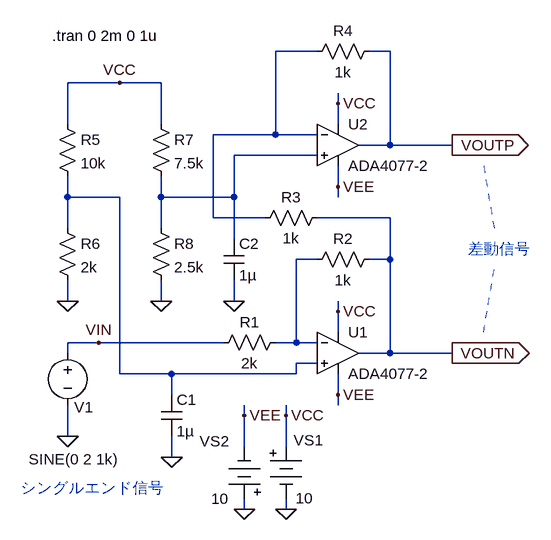
[diagram p0: schematic fig-02-06-09.asc]
fig-02-06-09.asc, the LTspice schematic file:
Version 4
SHEET 1 880 724
WIRE 176 0 112 0
WIRE 288 0 256 0
WIRE -128 48 -208 48
WIRE -64 48 -128 48
WIRE 208 80 208 64
WIRE -208 112 -208 48
WIRE -64 112 -64 48
WIRE 208 112 208 80
WIRE 112 128 112 0
WIRE 112 128 16 128
WIRE 176 128 112 128
WIRE 288 144 288 0
WIRE 288 144 240 144
WIRE 384 144 288 144
WIRE 176 160 48 160
WIRE 208 208 208 176
WIRE -208 224 -208 192
WIRE -128 224 -208 224
WIRE -64 224 -64 192
WIRE 48 224 48 160
WIRE 48 224 -64 224
WIRE 208 224 208 208
WIRE 16 256 16 128
WIRE 96 256 16 256
WIRE 288 256 176 256
WIRE -208 272 -208 224
WIRE -64 272 -64 224
WIRE 48 288 48 224
WIRE 176 320 144 320
WIRE 288 320 288 256
WIRE 288 320 256 320
WIRE -208 384 -208 352
WIRE -64 384 -64 352
WIRE 48 384 48 352
WIRE 208 400 208 384
WIRE 208 432 208 400
WIRE -160 448 -208 448
WIRE 32 448 -160 448
WIRE 144 448 144 320
WIRE 144 448 112 448
WIRE 176 448 144 448
WIRE -208 464 -208 448
WIRE 288 464 288 320
WIRE 288 464 240 464
WIRE 384 464 288 464
WIRE 176 480 144 480
WIRE -128 496 -128 224
WIRE -48 496 -128 496
WIRE 144 496 144 480
WIRE 144 496 -48 496
WIRE -48 528 -48 496
WIRE 208 528 208 496
WIRE 208 544 208 528
WIRE 64 560 64 544
WIRE 128 560 128 544
WIRE -208 592 -208 544
WIRE 64 608 64 560
WIRE 128 608 128 560
WIRE -48 624 -48 592
WIRE 64 704 64 688
WIRE 128 704 128 688
FLAG -208 592 0
FLAG 384 464 VOUTN
IOPIN 384 464 Out
FLAG -160 448 VIN
FLAG 64 704 0
FLAG 128 704 0
FLAG 64 560 VEE
FLAG 128 560 VCC
FLAG 208 80 VCC
FLAG 208 208 VEE
FLAG 208 400 VCC
FLAG 208 528 VEE
FLAG 384 144 VOUTP
IOPIN 384 144 Out
FLAG -48 624 0
FLAG -64 384 0
FLAG -208 384 0
FLAG 48 384 0
FLAG -128 48 VCC
SYMBOL voltage -208 448 R0
WINDOW 0 10 99 Left 2
WINDOW 3 -60 179 Left 2
WINDOW 123 0 0 Left 0
WINDOW 39 0 0 Left 0
SYMATTR InstName V1
SYMATTR Value SINE(0 2 1k)
SYMBOL Misc\\battery 128 592 R0
WINDOW 0 12 6 Left 2
WINDOW 3 15 95 Left 2
SYMATTR InstName VS1
SYMATTR Value 10
SYMBOL Misc\\battery 64 704 R180
WINDOW 0 24 104 Left 2
WINDOW 3 24 16 Left 2
WINDOW 123 0 0 Left 0
WINDOW 39 0 0 Left 0
SYMATTR InstName VS2
SYMATTR Value 10
SYMBOL Opamps\\ADA4077-2 208 80 R0
SYMATTR InstName U2
SYMBOL res 128 432 R90
WINDOW 0 0 56 VBottom 2
WINDOW 3 32 56 VTop 2
SYMATTR InstName R1
SYMATTR Value 2k
SYMBOL Opamps\\ADA4077-2 208 400 R0
SYMATTR InstName U1
SYMBOL res 272 304 R90
WINDOW 0 0 56 VBottom 2
WINDOW 3 32 56 VTop 2
SYMATTR InstName R2
SYMATTR Value 1k
SYMBOL res 192 240 R90
WINDOW 0 0 56 VBottom 2
WINDOW 3 32 56 VTop 2
SYMATTR InstName R3
SYMATTR Value 1k
SYMBOL res 272 -16 R90
WINDOW 0 0 56 VBottom 2
WINDOW 3 32 56 VTop 2
SYMATTR InstName R4
SYMATTR Value 1k
SYMBOL res -224 96 R0
SYMATTR InstName R5
SYMATTR Value 10k
SYMBOL res -224 256 R0
SYMATTR InstName R6
SYMATTR Value 2k
SYMBOL res -80 96 R0
SYMATTR InstName R7
SYMATTR Value 7.5k
SYMBOL res -80 256 R0
SYMATTR InstName R8
SYMATTR Value 2.5k
SYMBOL cap -64 528 R0
SYMATTR InstName C1
SYMATTR Value 1µ
SYMBOL cap 32 288 R0
SYMATTR InstName C2
SYMATTR Value 1µ
TEXT -232 -24 Left 2 !.tran 0 2m 0 1u
TEXT -280 672 Left 2 ;シングルエンド信号
TEXT 408 304 Left 2 ;差動信号
LINE Normal 432 176 448 272 2
LINE Normal 432 432 448 336 2
LINE Normal 432 432 432 432 2

The netlist it stands for:
* fig-02-06-09.asc
V1 VIN 0 SINE(0 2 1k)
VS1 VCC 0 10
VS2 0 VEE 10
XU2 N002 N001 VCC VEE VOUTP ADA4077-2  ; pins In+ In- V+ V- OUT
R1 N004 VIN 2k
XU1 N003 N004 VCC VEE VOUTN ADA4077-2  ; pins In+ In- V+ V- OUT
R2 VOUTN N004 1k
R3 VOUTN N001 1k
R4 VOUTP N001 1k
R5 VCC N003 10k
R6 N003 0 2k
R7 VCC N002 7.5k
R8 N002 0 2.5k
C1 N003 0 1µ
C2 N002 0 1µ
.tran 0 2m 0 1u
* シングルエンド信号
* 差動信号
.backanno
.end